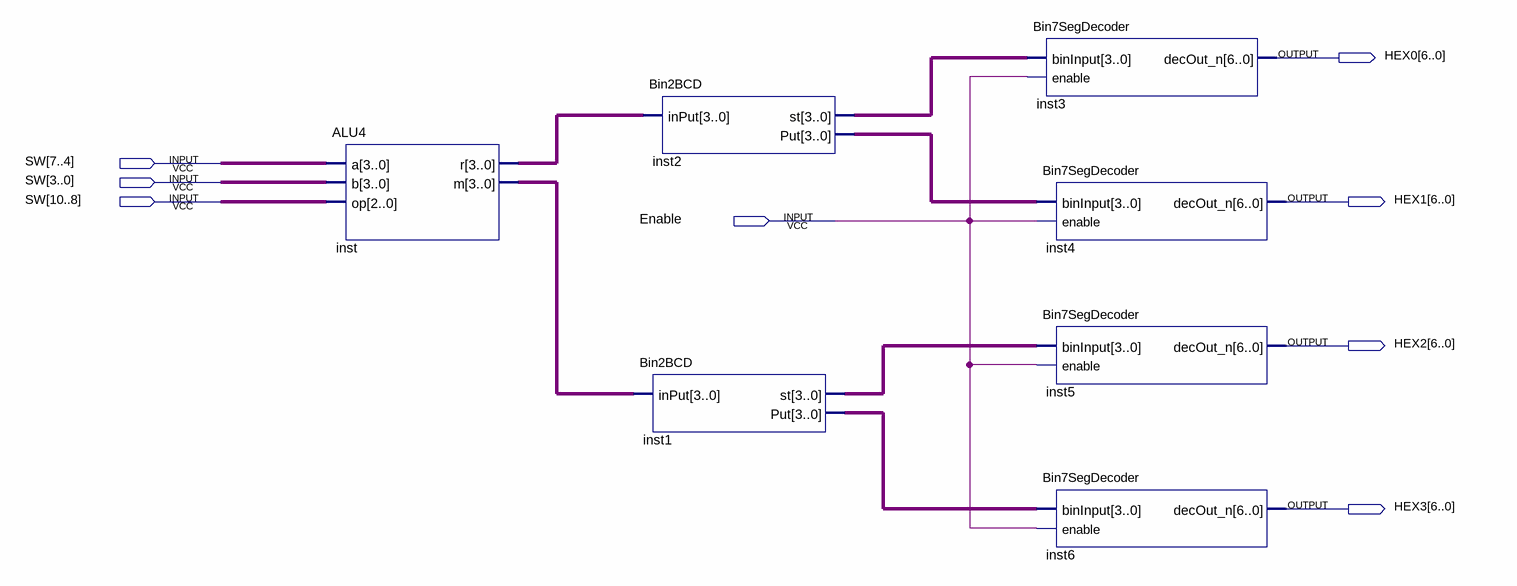
[diagram p0: schematic sheet]
// Quartus schematic ALUDemo1.bdf as structural Verilog: 7 symbols, 8 pins
module ALUDemo1 (
  input  [10:0] SW,
  input  Enable,
  output [6:0] HEX0,
  output [6:0] HEX1,
  output [6:0] HEX2,
  output [6:0] HEX3
);

  wire [3:0] inst1_put, inst1_st, inst2_put, inst2_st, inst_m, inst_r;

  ALU4 inst (.a(SW[7:4]), .b(SW[3:0]), .op(SW[10:8]), .r(inst_r), .m(inst_m));
  Bin2BCD inst2 (.inPut(inst_r), .st(inst2_st), .Put(inst2_put));
  Bin2BCD inst1 (.inPut(inst_m), .st(inst1_st), .Put(inst1_put));
  Bin7SegDecoder inst3 (.binInput(inst2_st), .enable(Enable), .decOut_n(HEX0));
  Bin7SegDecoder inst4 (.binInput(inst2_put), .enable(Enable), .decOut_n(HEX1));
  Bin7SegDecoder inst5 (.binInput(inst1_st), .enable(Enable), .decOut_n(HEX2));
  Bin7SegDecoder inst6 (.binInput(inst1_put), .enable(Enable), .decOut_n(HEX3));
endmodule
